# Altium schematic sheet A1H1.SchDoc
size 840 x 594 mm
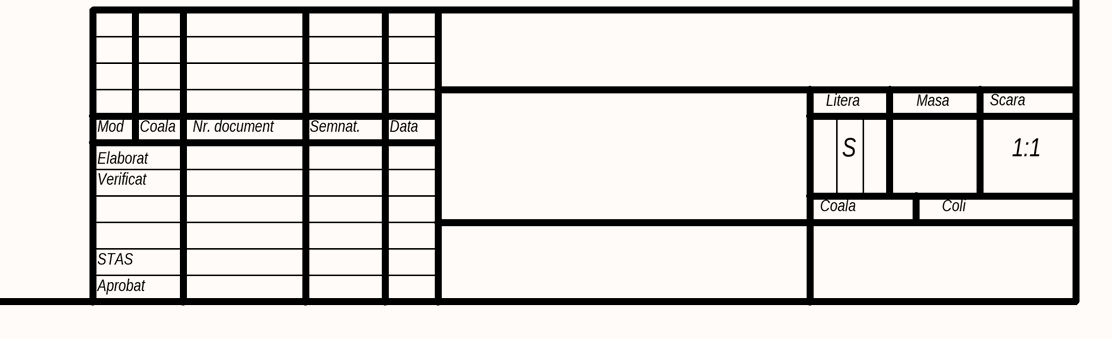
[diagram p0: A1H1.SchDoc, bottom right]

## Notes on the sheet
- Mod
- Coala
- Nr. document
- Semnat.
- Data
- Litera
- Masa
- Scara
- Elaborat
- Verificat
- S
- Coli
- 1:1
- STAS
- Aprobat